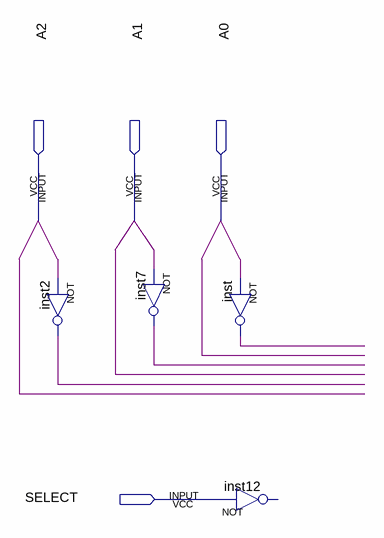
[diagram p0: schematic sheet]
// Quartus schematic segment_base.bdf as structural Verilog: 4 symbols, 4 pins
module segment_base (
  input  A2,
  input  A1,
  input  A0,
  input  SELECT
);

  wire inst2_out, inst7_out, inst_out;

  not inst2 (inst2_out, A2);
  not inst7 (inst7_out, A1);
  not inst (inst_out, A0);
  // NOT inst12 has open pins: IN=SELECT, OUT=open
endmodule
